# EAGLE board qcd-23 (EAGLE 7.2.0)
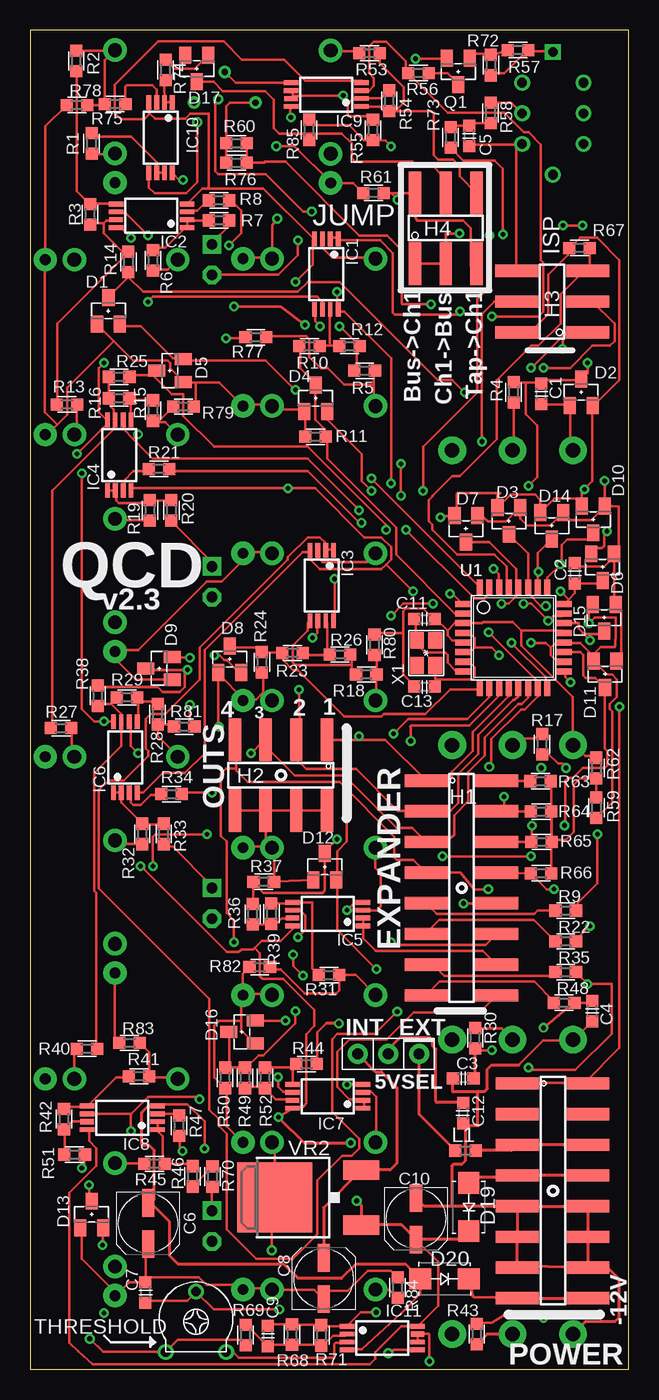
[diagram p1: board, top side]
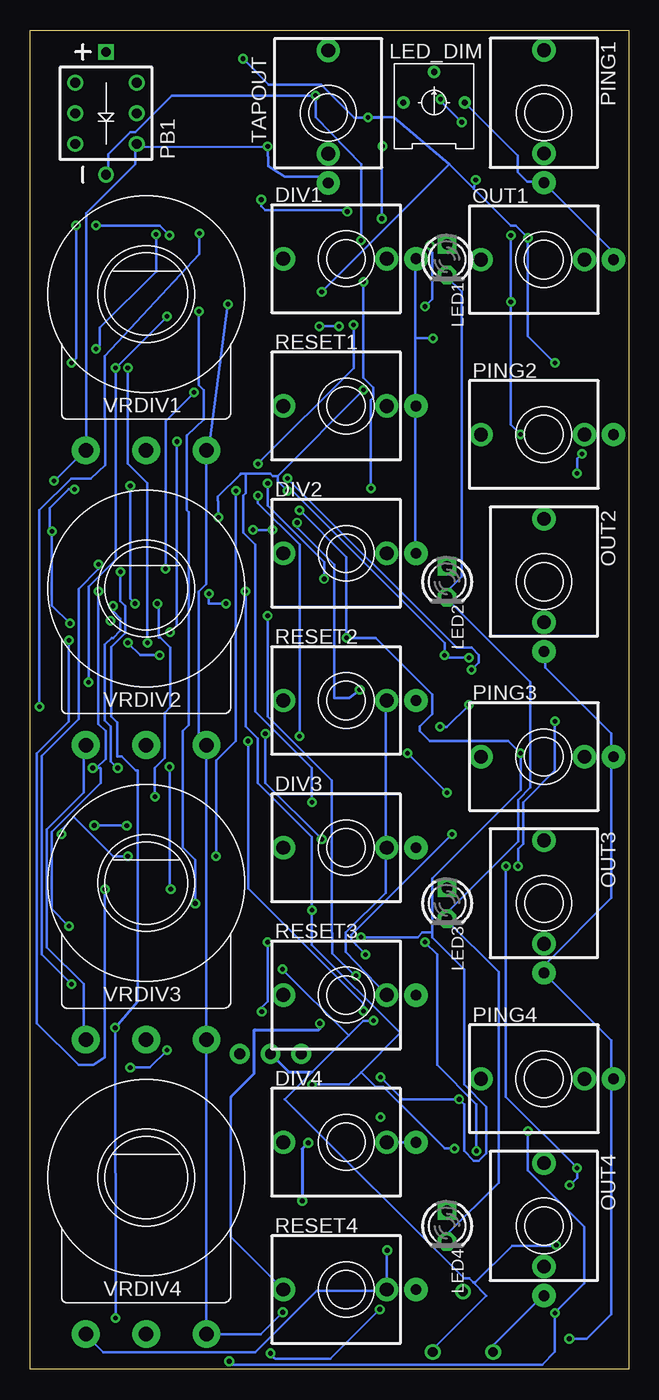
[diagram p2: board, bottom side, seen from below]

Size 49.53 x 110.87 mm. Coordinates in mm from the lower left corner, seen from the top.
Outline: 0,0 49.53,0 49.53,110.87 0,110.87 0,0
Copper layers (1*16): Top 0.035mm / dielectric 1.5mm / Bottom 0.035mm
Design rules "default *": minimum track width 8mil, minimum drill 15mil, track to track 8mil, track to pad 8mil, pad to pad 8mil, via to via 8mil, smd to smd 8mil, copper to edge 10mil, drill to drill 8mil, minimum pad ring 10mil, minimum via ring 8mil, stop-mask expansion 4mil, vias tented up to drill 16mil, thermal gap 10mil

## Footprints (pad centres in the part's own frame; a part is rotated, then mirrored left to right if it is on the bottom)
HEADER-1X3-TH = drill 0.9 pad 1.651: P$1 0,2.54; P$2 0,0; P$3 0,-2.54
C0603 = smd 1 x 1: 1 -0.85,0; 2 0.85,0
C-POL-5 = smd 2.3 x 1: + 1.725,0; - -1.7,0
SOT23 = smd 1 x 1.4: 1 -0.95,-1.1; 2 0.95,-1.1; 3 0,1.1
SMA = smd 1.8 x 1.7: A -2,0; K 2,0
PJ301M-12-FIX = drill 1.143 pad 1.93: 1 -5.207,0; 3 3.353,0 | drill 0.889 pad 1.93: 2 5.766,0
HEADER-2X8-SMT = smd 1.016 x 3.556: 1 -8.89,-2.95; 2 -8.89,2.899; 3 -6.35,-2.95; 4 -6.35,2.899; 5 -3.81,-2.95; 6 -3.81,2.899; 7 -1.27,-2.95; 8 -1.27,2.899; 9 1.27,-2.95; 10 1.27,2.899; 11 3.81,-2.95; 12 3.81,2.899; 13 6.35,-2.95; 14 6.35,2.899; 15 8.89,-2.95; 16 8.89,2.899
HEADER-2X4-SMT = smd 1.016 x 3.556: 1 -3.81,-2.95; 2 -3.81,2.899; 3 -1.27,-2.95; 4 -1.27,2.899; 5 1.27,-2.95; 6 1.27,2.899; 7 3.81,-2.95; 8 3.81,2.899
HEADER-2X3-SMT = smd 1.016 x 3.556: 1 -2.54,-2.95; 2 -2.54,2.899; 3 0,-2.95; 4 0,2.899; 5 2.54,-2.95; 6 2.54,2.899
TSSOP8 = smd 0.4 x 1.2: 1 -0.975,-2.925; 2 -0.325,-2.925; 3 0.325,-2.925; 4 0.975,-2.925; 5 0.975,2.925; 6 0.325,2.925; 7 -0.325,2.925; 8 -0.975,2.925
0603 = smd 1 x 1: 1 -0.85,0; 2 0.85,0
LED-T1 = drill 0.889 pad 1.524 square: A -1.27,0 | drill 0.889 pad 1.524 octagon: K 1.27,0
TRIM-T73YE = drill 0.508 pad 1.016: 1 -2.54,0; 2 0,2.54; 3 2.54,0
BUTTON-LED-PB61303 = drill 0.8: P$1 2.54,2.54; P$2 0,2.54; P$3 -2.54,2.54; P$4 2.54,-2.54; P$5 0,-2.54; P$6 -2.54,-2.54; P$8 -5.08,0 | drill 0.8 square: P$7 5.08,0
R0603 = smd 1 x 1: 1 -0.85,0; 2 0.85,0
PIHER-6MM = drill 0.8: 1 -2.5,-2.5; 2 0,2.5; 3 2.5,-2.5
TQFP-32 = smd 1.25 x 0.5: 1 -4.2,2.8; 2 -4.2,2; 3 -4.2,1.2; 4 -4.2,0.4; 5 -4.2,-0.4; 6 -4.2,-1.2; 7 -4.2,-2; 8 -4.2,-2.8; 17 4.2,-2.8; 18 4.2,-2; 19 4.2,-1.2; 20 4.2,-0.4; 21 4.2,0.4; 22 4.2,1.2; 23 4.2,2; 24 4.2,2.8 | smd 0.5 x 1.25: 9 -2.8,-4.2; 10 -2,-4.2; 11 -1.2,-4.2; 12 -0.4,-4.2; 13 0.4,-4.2; 14 1.2,-4.2; 15 2,-4.2; 16 2.8,-4.2; 25 2.8,4.2; 26 2,4.2; 27 1.2,4.2; 28 0.4,4.2; 29 -0.4,4.2; 30 -1.2,4.2; 31 -2,4.2; 32 -2.8,4.2
DPAK = smd 1.6 x 3: 1 -2.28,-4.8; 3 2.28,-4.8 | smd 5.8 x 6.2: 4 0,2.38
16MM-RV16AF-4A = drill 1.2 pad 2.286: 1 -5,-12.954; 2 0,-12.954; 3 5,-12.954
FA-238 = smd 1.4 x 1.15: 1 -1.05,-0.75; 2 1.05,-0.75; 3 1.05,0.75; 4 -1.05,0.75

## Placement (x,y rotation side)
5VSEL  HEADER-1X3-TH  [HEADER-1X3-TH]  29.64,26.11 270 top
C1  10nF  [C0603]  42.29,80.77 270 top
C2  10nF  [C0603]  45.09,65.91 90 top
C3  10nF  [C0603]  35.84,24.1 180 top
C4  10nF  [C0603]  46.51,29.67 270 top
C5  0.1uF  [C0603]  36.32,102.11 270 top
C6  47uF  [C-POL-5]  9.75,12.09 270 top
C7  0.1uF  [C0603]  9.53,6.35 270 top
C8  47uF  [C-POL-5]  24.28,7.52 90 top
C9  0.1uF  [C0603]  19.66,2.77 270 top
C10  47uF  [C-POL-5]  31.93,12.47 270 top
C11  9pF  [C0603]  32.64,62.1 0 top
C12  0.1uF  [C0603]  35.84,21.21 90 top
C13  9pF  [C0603]  32.64,56.52 180 top
D1  BAT54S  [SOT23]  6.48,87.63 0 top
D2  BAT54S  [SOT23]  45.59,80.9 0 top
D3  BAT54S  [SOT23]  39.62,70.23 180 top
D4  BAT54S  [SOT23]  23.62,80.39 0 top
D5  BAT54S  [SOT23]  11.56,82.68 90 top
D6  BAT54S  [SOT23]  47.37,66.42 180 top
D7  BAT54S  [SOT23]  36.07,69.6 180 top
D8  BAT54S  [SOT23]  16.51,58.8 0 top
D9  BAT54S  [SOT23]  10.67,58.04 90 top
D10  BAT54S  [SOT23]  46.61,70.36 180 top
D11  BAT54S  [SOT23]  47.57,57.56 180 top
D12  BAT54S  [SOT23]  24.38,41.61 0 top
D13  BAT54S  [SOT23]  5.08,12.83 0 top
D14  BAT54S  [SOT23]  43.18,69.85 180 top
D15  BAT54S  [SOT23]  47.5,62.23 180 top
D16  BAT54S  [SOT23]  17.53,27.94 90 top
D17  BAT54S  [SOT23]  13.79,107.7 180 top
D19  B140-E3  [SMA]  36.3,13.44 270 top
D20  B140-E3  [SMA]  34.29,7.49 0 top
DIV1  [PJ301M-12-FIX]  23.37,91.95 0 bottom
DIV2  [PJ301M-12-FIX]  23.37,67.56 0 bottom
DIV3  [PJ301M-12-FIX]  23.37,43.18 0 bottom
DIV4  [PJ301M-12-FIX]  23.37,18.8 0 bottom
H1  HEADER-2X8BARE  [HEADER-2X8-SMT]  35.71,39.85 270 top
H2  HEADER-2x4-MALE-SMT  [HEADER-2X4-SMT]  20.75,49.17 180 top
H3  HEADER-2x3-MALE-SMT  [HEADER-2X3-SMT]  43.18,88.39 90 top
H4  HEADER-2x3-MALE-SMT  [HEADER-2X3-SMT]  34.39,94.49 0 top
IC1  TL072  [TSSOP8]  24.51,90.68 180 top
IC2  TL072  [TSSOP8]  10.03,95.5 90 top
IC3  TL072  [TSSOP8]  24.13,64.9 180 top
IC4  TL072  [TSSOP8]  7.37,75.69 0 top
IC5  TL072  [TSSOP8]  24.64,37.69 90 top
IC6  TL072  [TSSOP8]  7.87,50.67 0 top
IC7  TL072  [TSSOP8]  24.64,22.61 90 top
IC8  TL072  [TSSOP8]  7.62,20.83 90 top
IC9  TL072  [TSSOP8]  24.51,105.54 90 top
IC10  TL072  [TSSOP8]  10.79,101.98 180 top
IC11  TL072  [TSSOP8]  29.13,2.59 270 top
L1  BEAD  [0603]  36.02,18.11 180 top
LED1  RED  [LED-T1]  15.04,91.87 270 bottom
LED2  WHITE  [LED-T1]  15.04,65.2 270 bottom
LED3  BLUE  [LED-T1]  15.04,38.58 270 bottom
LED4  GREEN  [LED-T1]  15.04,11.86 270 bottom
LED_DIM  10k plastic  [TRIM-T73YE]  16.1,104.88 0 bottom
OUT1  [PJ301M-12-FIX]  7.01,91.87 0 bottom
OUT2  [PJ301M-12-FIX]  7.01,65.2 270 bottom
OUT3  [PJ301M-12-FIX]  7.01,38.58 270 bottom
OUT4  [PJ301M-12-FIX]  7.01,11.86 270 bottom
PB1  WHITE-MOM  [BUTTON-LED-PB61303]  43.26,103.99 90 bottom
PING1  [PJ301M-12-FIX]  7.01,104.01 270 bottom
PING2  [PJ301M-12-FIX]  7.01,77.39 0 bottom
PING3  [PJ301M-12-FIX]  7.01,50.72 0 bottom
PING4  [PJ301M-12-FIX]  7.01,24.05 0 bottom
POWER  HEADER-2X8-SMT  [HEADER-2X8-SMT]  43.26,14.78 270 top
Q1  2N5485  [SOT23]  35.43,107.44 180 top
R1  10k  [R0603]  5.08,101.5 270 top
R2  1k  [R0603]  3.81,108.33 270 top
R3  1M  [R0603]  4.95,95.63 270 top
R4  220k  [R0603]  40.01,80.9 90 top
R5  1k  [R0603]  27.69,82.68 180 top
R6  1k  [R0603]  10.16,91.82 90 top
R7  10k  [R0603]  15.62,95.12 180 top
R8  10k  [R0603]  15.62,96.77 0 top
R9  220k  [R0603]  44.32,37.97 0 top
R10  10k  [R0603]  23.11,84.71 180 top
R11  1M  [R0603]  23.62,77.22 0 top
R12  1M  [R0603]  26.42,84.71 180 top
R13  10k  [R0603]  3.05,79.88 0 top
R14  10k  [R0603]  8.13,91.69 90 top
R15  1k  [R0603]  10.16,79.38 90 top
R16  1M  [R0603]  7.37,80.39 180 top
R17  220k  [R0603]  42.37,51.77 270 top
R18  1k  [R0603]  27.81,57.53 180 top
R19  1k  [R0603]  9.91,71.12 90 top
R20  10k  [R0603]  11.68,71.12 90 top
R21  10k  [R0603]  10.67,74.55 0 top
R22  220k  [R0603]  44.32,35.43 0 top
R23  10k  [R0603]  21.72,59.31 180 top
R24  1M  [R0603]  19.18,58.55 90 top
R25  10k  [R0603]  7.37,82.17 180 top
R26  1M  [R0603]  25.65,59.18 180 top
R27  10k  [R0603]  2.54,53.09 0 top
R28  1k  [R0603]  10.54,54.23 90 top
R29  1M  [R0603]  8,55.63 180 top
R30  220k  [R0603]  36.83,27.43 270 top
R31  1k  [R0603]  24.74,32.64 180 top
R32  1k  [R0603]  9.27,44.32 90 top
R33  10k  [R0603]  11.05,44.32 90 top
R34  10k  [R0603]  11.68,47.62 0 top
R35  220k  [R0603]  44.32,32.89 0 top
R36  10k  [R0603]  18.41,37.67 90 top
R37  1M  [R0603]  19.33,40.36 180 top
R38  10k  [R0603]  5.59,55.75 270 top
R39  1M  [R0603]  19.96,37.72 270 top
R40  10k  [R0603]  4.7,26.54 180 top
R41  1k  [R0603]  9.02,24.26 180 top
R42  1M  [R0603]  2.79,20.7 270 top
R43  220k  [R0603]  36.96,2.92 90 top
R44  1k  [R0603]  22.86,25.27 180 top
R45  1k  [R0603]  10.29,17.02 0 top
R46  10k  [R0603]  13.44,15.98 90 top
R47  10k  [R0603]  12.32,20.19 270 top
R48  220k  [R0603]  44.2,30.35 0 top
R49  10k  [R0603]  17.78,24.13 90 top
R50  1M  [R0603]  16.13,24.13 90 top
R51  10k  [R0603]  3.68,17.78 180 top
R52  1M  [R0603]  19.43,24.13 270 top
R53  1k  [R0603]  28.07,108.97 0 top
R54  10k  [R0603]  29.72,105.03 90 top
R55  10k  [R0603]  28.37,102.62 270 top
R56  220k  [R0603]  32.13,107.31 180 top
R57  1k  [R0603]  40.39,109.22 180 top
R58  1k  [R0603]  38.1,104.01 270 top
R59  10k  [R0603]  46.86,46.48 270 top
R60  100k  [R0603]  17.07,101.5 0 top
R61  1M  [R0603]  28.42,97.38 180 top
R62  10k  [R0603]  46.86,49.78 270 top
R63  1M  [R0603]  42.24,48.69 0 top
R64  1M  [R0603]  42.27,46.18 0 top
R65  1M  [R0603]  42.32,43.66 0 top
R66  1M  [R0603]  42.27,41.07 0 top
R67  10k  [R0603]  45.47,92.84 0 top
R68  10k  [R0603]  21.67,2.87 90 top
R69  10k  [R0603]  17.83,2.84 90 top
R70  10k  [R0603]  15.09,15.95 90 top
R71  33k  [R0603]  24.1,2.82 90 top
R72  1k  [R0603]  38.13,107.98 90 top
R73  10k  [R0603]  34.8,101.98 270 top
R74  100  [R0603]  11.2,107.57 270 top
R75  1k  [R0603]  7.04,104.75 180 top
R76  33k  [R0603]  17.07,99.9 0 top
R77  1M  [R0603]  18.67,85.45 180 top
R78  1M  [R0603]  3.86,104.67 0 top
R79  1M  [R0603]  12.67,79.71 180 top
R80  1M  [R0603]  28.5,59.99 270 top
R81  1M  [R0603]  12.75,53.21 180 top
R82  1M  [R0603]  19,33.3 0 top
R83  1M  [R0603]  8.23,27.03 0 top
R84  1M  [R0603]  30.4,6.76 270 top
R85  1M  [R0603]  23.09,102.62 270 top
RESET1  [PJ301M-12-FIX]  23.37,79.76 0 bottom
RESET2  [PJ301M-12-FIX]  23.37,55.37 0 bottom
RESET3  [PJ301M-12-FIX]  23.37,30.99 0 bottom
RESET4  [PJ301M-12-FIX]  23.37,6.6 0 bottom
TAPOUT  [PJ301M-12-FIX]  24.87,103.99 270 bottom
THRESHOLD  100k  [PIHER-6MM]  13.72,3.94 0 top
U1  ATMEGA328  [TQFP-32]  40.01,60.58 0 top
VR2  78M05  [DPAK]  22.61,14.22 90 top
VRDIV1  16MM-21DET  [16MM-RV16AF-4A]  39.93,89.03 0 bottom
VRDIV2  16MM-21DET  [16MM-RV16AF-4A]  39.93,64.64 0 bottom
VRDIV3  16MM-21DET  [16MM-RV16AF-4A]  39.93,40.26 0 bottom
VRDIV4  16MM-21DET  [16MM-RV16AF-4A]  39.93,15.88 0 bottom
X1  16MHz  [FA-238]  32.77,59.31 90 top

## Tracks (layer width: path | path; a pad name or v marks a point on that pad's centre or on a via)
+5V  (via drill 0.38, 0.38 pad 0.79)
  Top 0.203: D6.2 46.9,68 47.32,68 47.5,68.17 47.5,69.37 v47.73,69.37 | D15.2 46.23,63.01 v46.23,61.75 46.74,62.26 48.44,62.26 48.46,62.23 48.46,60.5 48.44,60.48 48.44,59.89 48.36,59.82 47.22,59.82 46.62,59.22 D11.2 | v21.13,28.85 18.69,28.85 D16.2 | v5.99,10.29 6.02,10.77 6.1,11.58 D13.2 | D1.2 7.52,86.36 9.14,86.36 11.79,83.72 12.6,83.72 D5.2 12.8,83.52 19.51,83.52 v21.95,81.08 | v13.21,58.93 11.79,58.93 D9.2 | v15.24,59.13 15.65,59.13 16.05,58.73 16.26,58.73 17.27,57.71 D8.2 | v28.25,72.75 27.43,73.56 27.43,75.79 24.59,78.64 24.59,79.25 D4.2 | H3.2 40.44,85.95 41.45,85.95 42.88,87.38 42.88,90.63 44.5,92.25 44.5,92.66 R67.1 44.7,92.86 45.52,93.67 46.94,93.67 48.77,91.85 48.77,81.89 46.74,79.86 D2.2 46.53,79.65 46.53,73.56 45.92,72.95 v45.87,72.87 45.66,72.66 D10.2 45.66,71.64 45.19,72.11 43.39,72.11 D14.2 42.23,71.97 41.78,72.42 39.76,72.42 D3.2 38.67,72.33 38.91,72.57 35.36,72.57 35.31,72.52 35.31,70.88 D7.2 35.03,70.66 34.09,70.66 v33.96,70.54 | 36.78,59.74 36.58,59.54 35.97,59.54 U1.6 | 36.78,59.74 36.78,60.55 36.37,60.96 35.97,60.96 U1.4 | 43.08,59.74 43.08,59.13 43.48,58.73 44.09,58.73 U1.18 | 43.08,59.74 43.48,60.15 44.09,60.15 U1.20 44.3,60.15 45.52,60.15 46.53,59.13 D11.2 | 36.78,59.74 38.2,59.74 v38.81,59.13 | v41.45,60.15 42.67,60.15 43.08,59.74 | D11.2 46.74,58.52 47.75,57.51 48.16,57.51 48.56,57.1 48.56,55.68 47.95,55.07 47.95,54.66 48.16,54.46 48.16,46.94 46.94,45.72 R59.2 46.74,45.52 | IC11.3 26.15,2.21 25.3,2.21 25.15,2.06 25.15,0.94 17.25,0.94 16.75,1.44 THRESHOLD.3 | v28.65,33.12 25.4,36.37 25.4,40.44 D12.2 25.4,40.64 25.4,42.88 26.21,43.69 v26.21,46.94
  Top 0.254: C12.2 35.8,22.1 33.63,22.1 33.58,22.17 33.58,26.49 33.33,26.75 33.33,27.23 33.12,27.43 30.58,27.43 29.64,26.49 5VSEL.P$2
  Bottom 0.203: v45.87,72.87 46.33,72.87 47.9,71.3 47.9,69.55 v47.73,69.37 47.73,63.25 v46.23,61.75 | v21.13,28.85 21.95,28.85 23.16,27.64 | 23.16,27.64 26.19,24.61 28.45,22.35 13.61,7.52 13.21,7.52 12.88,7.19 | THRESHOLD.3 16.26,1.63 11.79,6.1 12.88,7.19 | v13.21,58.93 15.04,58.93 v15.24,59.13 15.24,60.15 27.84,72.75 v28.25,72.75 29.06,73.56 29.06,73.97 | 29.06,73.97 v21.95,81.08 | v38.81,59.13 40.44,59.13 v41.45,60.15 | 29.06,73.97 29.46,73.97 29.67,74.17 31.7,74.17 | 31.7,74.17 32.11,74.17 32.16,74.09 34.01,72.24 34.01,71.91 33.96,71.83 v33.96,70.54 | v28.65,33.12 23.16,27.64 | v5.99,10.29 6.04,10.24 9.65,10.24 12.7,7.19 12.88,7.19 | v26.21,46.94 26.21,49.78 30.89,54.46 30.89,68.28 31.9,69.29 31.9,72.34 31.7,72.54 31.7,74.17
  Bottom 0.254: 5VSEL.P$2 28.14,24.61 26.19,24.61
+12V  (via drill 0.38, 0.41)
  Top 0.203: IC8.8 4.88,19.71 4.88,18.9 5.49,18.29 5.49,16.87 3.25,14.63 3.25,2.21 3.96,1.5 5.16,0.41 28.12,0.41 28.57,0.86 28.57,1.42 30.72,3.57 IC11.8 33.76,5.26 33.76,8.89 31.93,10.72 C10.+ | v20.55,20.88 21.57,21.54 IC7.8 21.74,21.74 22.58,21.74 22.86,22.02 22.86,27.74 23.5,28.45 23.5,29.74 20.93,32.31 19.23,32.31 19,32.54 19,34.44 18.57,34.87 18.57,34.9 | v25.2,65.43 25.2,61.98 IC3.8 | v29.87,73.36 29.87,83.72 26.01,87.58 25.6,87.58 IC1.8 25.4,87.78 v25.4,89.2 | v4.27,74.17 4.27,54.66 5.28,53.65 v6.1,53.65 6.71,53.65 IC6.8 | v3.86,75.79 6.3,78.23 6.3,78.44 IC4.8 6.3,78.64 5.69,79.25 5.69,82.91 v6.1,83.31 | v8.33,93.67 7.52,94.49 7.11,94.49 IC2.8 | v21.57,103.66 21.54,104.44 IC9.8 | v31.9,108.51 34.34,108.51 Q1.2 | v9.14,41.66 16.26,34.54 17.27,34.54 17.51,34.78 18.45,34.78 18.57,34.9 | 21.54,36.58 IC5.8 21.71,36.47 20.73,35.48 19.15,35.48 18.57,34.9 | IC10.8 12.39,98.43 v12.65,98.48
  Top 0.254: D19.K 35.61,10.75 C10.+ 30.73,11.94 VR2.1 27.41,13.56 v27.03,13.95 | v20.55,20.88 22.68,18.75 v26.52,18.75
  Bottom 0.203: v25.2,65.43 25.2,66.85 29.87,71.53 v29.87,73.36 | v4.27,74.17 4.27,75.39 v3.86,75.79 | v6.1,83.31 8.33,85.55 v8.33,93.67 9.35,94.69 9.75,94.69 12.83,97.77 | 12.83,97.77 14.83,99.77 | 14.83,99.77 19.43,103.68 v21.57,103.66 21.31,103.61 20.42,103.63 22.71,103.63 25.45,106.38 29.77,106.38 v31.9,108.51 | 14.83,99.77 v25.4,89.2 | v9.14,41.66 9.14,43.08 8.74,43.48 8.74,46.94 6.1,49.58 v6.1,53.65 | v12.65,98.48 12.8,97.77 12.83,97.77
  Bottom 0.254: v26.52,18.75 27.03,18.24 v27.03,13.95
+VREF  (via drill 0.38, 0.41)
  Top 0.203: v33.17,88.19 30.81,88.19 30.73,88.27 30.73,92.66 29.87,93.52 29.87,93.55 29.54,93.88 27.23,93.88 21.13,99.97 19.43,99.97 19.36,99.9 R76.2 R60.2 | C9.1 19.76,3.72 R68.2 21.72,3.67 R71.2 24.21,3.57 IC11.1 27.37,4.72 v28.63,4.72
  Bottom 0.203: v33.17,88.19 34.75,76.2 VRDIV1.3 34.95,76 34.95,65.02 35.56,64.41 35.56,52.43 34.95,51.82 VRDIV2.3 34.95,51.61 34.95,27.43 VRDIV3.3 34.95,27.23 34.95,3.05 VRDIV4.3 30.43,2.92 v28.63,4.72
-12V  (via drill 0.38)
  Top 0.203: 9.96,13.61 C6.- 10.16,13.61 | v14.43,18.29 14.43,20.52 13.01,21.95 10.57,21.95 IC8.4 | 14.63,97.74 19.3,97.74 23.37,93.67 IC1.4 23.37,93.47 23.37,91.44 v21.95,90.02 | 14.63,97.74 14.22,97.74 13.01,96.52 IC2.4 | IC9.4 27.43,106.68 22.76,106.68 21.01,108.43 17.53,108.43 16,109.96 10.62,109.96 7.01,106.35 7.01,103.99 7.49,103.5 9.42,103.5 9.88,103.96 9.91,103.96 | IC6.4 8.94,47.75 9.35,47.75 10.97,49.38 12.8,49.38 14.43,51 14.43,59.54 22.55,67.67 22.96,67.67 IC3.4 23.16,67.67 23.16,67.06 23.98,66.24 29.06,66.24 29.46,66.65 | 29.46,66.65 29.87,67.06 29.87,68.07 29.06,68.89 27.64,68.89 23.57,72.95 v21.34,72.95 8.53,72.95 IC4.4 | v26.21,23.57 27.43,23.57 IC7.4 | IC11.4 26.27,1.68 27.46,1.68 30.73,4.7 32.29,6.25 D20.A | v26.21,38 26.82,38.61 27.43,38.61 IC5.4 | 29.46,66.65 v31.7,64.41 | 9.8,104.92 IC10.4 9.82,104.05 9.91,103.96 | 14.63,97.74 14.78,97.89 14.78,103.96 13.26,103.96 12.83,103.53 10.34,103.53 9.91,103.96
  Top 0.254: D20.A 31.07,8.71 26.95,8.71 25.76,7.52 22.17,7.52 20.98,8.71 12.24,8.71 11.54,9.41 11.54,12.23 9.98,13.79 | 9.98,13.79 C6.- | 9.98,13.79 10.29,14.09 10.29,18.11 9.86,18.54 9.35,18.54 9.25,18.64 9.25,21.26 9.79,21.8 IC8.4
  Bottom 0.203: v26.21,23.57 23.16,23.57 22.15,24.59 | 22.15,24.59 18.9,27.84 26.21,35.15 v26.21,38 26.21,44.09 30.68,48.56 30.68,52.22 31.7,53.24 v31.7,64.41 | v21.95,90.02 21.95,82.09 21.13,81.28 21.13,80.47 21.34,80.26 v21.34,72.95 | v14.43,18.29 15.24,18.29 20.32,23.37 20.93,23.37 22.15,24.59
CLKIN1-SIG
  Top 0.203: R2.1 6.97,109.18 PING1.1 6.19,108.39 R75.2 6.11,104.67 R78.2
CLKIN1-SW
  Top 0.203: IC10.7 IC10.6 10.47,99.94 8.36,102.06 5.37,102.06 R1.1
DIV1_A  (via drill 0.38, 0.41)
  Top 0.203: IC1.2 24.99,93.67 25.4,93.67 IC1.1 25.6,93.47 28.98,93.47 30.02,92.43 30.02,87.48 30.18,87.33 35.31,87.33 v35.56,87.58 | v35.87,38.56 38.1,38.56 38.12,38.58 H1.10
  Bottom 0.203: v35.56,87.58 35.56,81.48 35.15,81.08 35.15,78.64 36.52,77.34 36.58,77.29 36.58,71.14 36.4,70.97 36.4,53.37 36.91,52.86 36.91,43.2 35.87,42.19 v35.87,38.56
DIV1_B
  Top 0.203: H1.9 33.65,37.69 41.73,37.69 42.01,37.97 R9.1
DIV2_A  (via drill 0.38, 0.41)
  Top 0.203: IC3.1 24.99,67.87 24.59,67.87 IC3.2 24.38,67.87 24.38,68.48 23.98,68.89 22.96,68.89 21.34,67.26 21.34,67.06 14.02,59.74 14.02,57.1 11.18,54.25 9.96,54.25 9.55,53.85 9.55,51.41 9.75,51.21 9.75,50.8 7.72,48.77 6.5,48.77 5.69,47.95 5.69,39.83 14.83,30.68 14.83,21.49 15.65,20.68 15.65,20.12 16.26,19.51 16.26,11.58 18.69,9.14 21.74,9.14 23.77,11.18 23.77,15.65 25.81,17.68 26.62,17.68 27.23,18.29 27.23,19.1 24.99,21.34 24.99,27.33 25.43,27.76 28.52,27.76 v30.38,29.62 | H1.12 37.7,35.13 29.87,35.13 | 29.87,35.13 29.49,35.13 | v29.87,35.36 29.87,35.13
  Bottom 0.203: v29.87,35.36 29.87,30.48 30.38,29.97 v30.38,29.62
DIV2_B
  Top 0.203: R22.1 43.46,35.41 41.66,37.21 33.86,37.21 32.76,36.12 H1.11
DIV3_A
  Top 0.203: H1.14 37.47,34.65 28.6,34.65 27.56,35.68 IC5.1 IC5.2
DIV3_B
  Top 0.203: R35.1 43.14,32.56 34.27,32.56 33.33,33.5 H1.13
DIV4_A
  Top 0.203: IC7.1 27.64,21.74 27.64,22.15 IC7.2 27.43,22.35 26.42,22.35 25.4,23.37 25.4,26.26 26.47,27.33 29.52,27.33 31.75,29.57 37.22,29.57 H1.16
DIV4_B
  Top 0.203: 43.28,30.28 R48.1 43.35,30.47 41.71,32.11 33.91,32.11 H1.15
GND  (via drill 0.38, 0.41)
  Top 0.203: C2.2 45.4,66.45 47.5,66.45 48.32,67.27 D6.1 | D6.1 48.69,67.66 48.69,71.45 48.18,71.46 D10.1 | D10.1 46.43,70.33 44.55,70.33 44.13,70.75 D14.1 43.03,69.85 41.15,69.85 40.57,70.42 D3.1 39.37,70.21 37.9,70.21 37.33,70.7 D7.1 | D6.1 48.32,63.46 D15.1 48.92,62.86 48.92,59.05 D11.1 | 19.51,43.28 19.91,43.28 DIV3.3 20.18,43.02 R37.1 20.4,40.4 D12.1 | 19.51,43.28 17.68,43.28 DIV3.2 | 17.68,55.47 15.65,57.51 D8.1 15.56,53.25 v15.62,53.19 | 19.3,56.08 19.3,57.51 R24.1 | RESET2.3 19.3,56.08 | 17.68,55.47 18.69,55.47 19.3,56.08 | 17.68,55.47 RESET2.2 | R62.1 46.74,50.8 45.92,50.8 45.11,51.61 VRDIV2.1 44.91,51.82 44.91,55.68 40.64,59.94 40.64,61.16 | 30.89,60.96 30.89,62.79 31.09,62.99 32.51,62.99 33.33,62.18 C11.2 33.53,62.18 34.54,61.16 | 30.89,60.96 30.89,57.51 31.7,56.69 C13.2 | 34.54,61.16 34.54,60.76 34.95,60.35 35.76,60.35 U1.5 | 34.54,61.16 35.15,61.77 35.76,61.77 U1.3 | 40.64,61.16 44.09,61.16 U1.21 | 36.37,61.77 35.97,61.77 U1.3 | 9.55,7.52 9.55,9.75 9.96,10.16 C6.+ | 9.55,7.52 9.55,7.32 C7.1 | D13.1 4.27,11.58 4.27,9.14 6.91,6.5 6.91,6.1 OUT4.2 7.11,6.1 8.22,7.2 C7.1 | 9.55,7.52 C7.1 | 17.48,28.85 17.48,30.89 RESET3.2 | 17.48,28.85 17.48,28.04 18.49,27.03 D16.1 | RESET3.2 17.68,31.09 19.91,31.09 RESET3.3 | 34.01,13.56 33.53,13.54 | 40.44,25.2 42.47,27.23 44.91,27.23 VRDIV3.1 44.99,27.3 C4.2 | 46.74,8.33 45.92,8.33 POWER.14 | 17.48,28.85 15.65,28.85 15.24,28.45 15.24,24.18 16.05,23.37 R50.1 16.26,23.16 16.26,20.12 17.58,18.8 DIV4.2 | v29.87,101.24 29.44,101.73 R55.2 27.62,101.77 26.39,103 23.56,103 R85.1 | C1.2 42.47,79.86 44.5,79.86 D2.1 44.7,79.65 44.7,76.4 44.91,76.2 VRDIV1.1
  Top 0.203: 40.23,101.4 40.64,101.4 PB1.P$6 40.23,101.4 | 40.23,101.4 36.37,101.4 C5.2 | 39.83,90.83 40.23,90.83 H3.6 40.23,91.03 40.23,101.4 | v47.55,73.56 47.55,71.53 D10.1 | D9.1 11.58,57.1 8.74,57.1 7.11,58.73 7.11,59.33 OUT2.2 7.11,59.54 8.94,59.54 14.63,65.23 15.85,65.23 17.48,66.85 17.48,67.46 DIV2.2 17.68,67.67 19.91,67.67 DIV2.3 | DIV1.2 17.68,92.05 19.91,92.05 DIV1.3 20.02,94.74 v20.45,95.28 | R11.1 22.76,77.22 22.76,79.25 D4.1 22.55,79.45 20.32,79.45 RESET1.3 19.91,79.86 17.68,79.86 RESET1.2 17.48,79.86 15.65,81.69 13.72,81.69 | 13.72,81.69 12.8,81.69 D5.1 12.6,81.89 11.58,82.91 11.58,83.31 11.38,83.52 8.53,83.52 6.91,85.14 | 6.91,85.14 5.69,86.36 D1.1 | 2.23,78.23 3.05,79.05 3.05,81.28 6.91,85.14 | 2.23,78.23 1.42,77.42 PING2.2 | 2.23,78.23 1.22,79.25 1.22,91.85 OUT1.2 1.25,102.91 R78.1 | R69.1 17.39,2.44 12.19,2.44 11.38,1.63 THRESHOLD.1 6.03,1.44 v4.93,2.54 | DIV4.3 20.23,18.59 VR2.4 19.99,13.99 v19.99,9.86 | H2.8 H2.6 | H2.6 21.95,46.27 | 21.95,46.27 H2.4 | H2.4 H2.2 | H2.6 19.51,46.25 19.51,43.28 | 40.64,61.16 39.93,61.87 37.52,61.87 37.42,61.78 U1.3 | H2.4 21.95,46.33 21.95,46.27 | v20.37,101.27 21.87,101.27 24.87,98.27 TAPOUT.2 26.73,98.22 R61.2 | C7.1 9.53,7.62 13.97,7.62 14.61,6.99 17.14,6.99 RESET4.2 17.68,6.71 19.91,6.71 RESET4.3 23.5,6.6 C8.- 24.28,6.02 24.77,6.5 26.29,6.5 27.94,8.15 29.86,8.15 R84.1 | R77.2 17.74,85.37 v16.2,85.37 | R79.1 13.72,79.9 13.72,81.69 | R80.1 28.61,60.96 30.89,60.96 | R81.1 13.21,53.61 v13.21,55.02 | R82.1 17.6,32.75 RESET3.2 | R83.1 7.01,27.39 OUT3.2
  Top 0.254: POWER.9 POWER.10 POWER.12 POWER.14 | POWER.13 POWER.11 POWER.9 | POWER.14 39.6,8.51 38.91,8.51 38.84,8.59 38.84,8.43 38.91,8.36 | 34.87,13.54 33.53,13.54 32.56,13.54 C10.- | 34.87,13.54 38.02,13.54 POWER.9 | RESET4.3 20.68,6.6 | VRDIV4.1 45.97,3.96 48.41,3.96 48.74,4.29 48.74,7.44 47.75,8.43 POWER.14 | 34.87,13.54 34.87,16.82 35.03,16.97 35.71,16.97 36.02,17.27 36.02,20.18 C12.1 36.01,20.19 37.11,20.19 37.03,20.27 37.03,22.96 | 37.03,22.96 34.98,22.96 34.99,22.98 C3.2 | 37.03,22.96 37.08,23.01 37.62,23.01 37.85,23.24 37.85,24.84 38.2,25.2 40.44,25.2
  Bottom 0.203: 11.38,1.42 THRESHOLD.1 11.18,1.63 11.18,2.03 7.11,6.1 OUT4.2 6.91,6.1 | VRDIV2.1 45.11,51.61 45.11,47.75 48.16,44.7 48.16,34.95 45.11,31.9 45.11,27.43 VRDIV3.1 | 40.84,101.19 40.84,101.4 PB1.P$6 40.84,101.19 | 40.84,101.19 v29.87,101.24 29.84,99.59 28.47,98.75 25.4,98.75 TAPOUT.2 | v47.55,73.56 45.11,76 VRDIV1.1 44.91,76.2 44.91,95.71 40.84,99.77 40.84,101.19 | OUT2.2 6.91,59.33 6.91,58.12 1.42,52.63 1.42,50.8 PING3.2 1.42,50.6 1.42,39.01 6.91,33.53 6.91,32.92 OUT3.2 1.42,27.23 1.42,24.18 PING4.2 1.42,23.98 1.42,4.57 3.45,2.54 v4.93,2.54 | OUT1.2 1.42,92.05 1.42,92.66 PING1.2 7.11,98.35 8.41,98.35 9.17,99.11 9.17,100.48 LED_DIM.3 | DIV2.2 17.68,67.67 17.68,79.65 RESET1.2 17.68,79.86 17.68,85.37 | 17.68,85.37 17.68,91.85 DIV1.2 | DIV4.2 DIV4.3 | v19.99,9.86 20.02,9.83 RESET4.3 20.12,6.5 25.81,6.5 30.89,1.42 43.48,1.42 44.91,2.85 VRDIV4.1 | RESET2.3 20.12,55.27 20.12,43.28 DIV3.3 20.12,43.08 20.12,39.42 23.42,36.17 23.39,34.54 RESET3.3 | v20.37,101.27 20.45,101.19 v20.45,95.28 | v16.2,85.37 17.68,85.37 | v13.21,55.02 15.04,53.19 v15.62,53.19
LED_BIAS  (via drill 0.38)
  Top 0.203: 21.74,105.46 21.74,105.66 IC9.6 | 21.74,105.46 21.74,105.26 IC9.7 | v25.91,105.46 21.74,105.46 | v22.15,93.47 22.15,92.25 20.52,90.63 15.04,90.63 LED1.K
  Bottom 0.203: LED4.K 15.04,11.18 10.77,15.44 10.77,32.92 15.04,37.19 LED3.K 15.04,37.8 9.14,43.69 9.14,47.14 8.13,48.16 8.13,56.9 15.04,63.8 LED2.K 15.04,64.41 13.82,65.63 13.82,89.2 15.04,90.42 LED1.K | PB1.P$8 43.08,98.96 43.08,100.58 41.25,102.41 40.84,102.41 37.8,105.46 v25.91,105.46 25.91,103.66 22.15,99.77 v22.15,93.47
N$1
  Top 0.203: R1.2 5.08,100.58 6.91,100.58 PING1.3
N$2
  Top 0.203: R75.1 7.89,106.18 8,106.3 10.11,106.3 10.47,105.94 IC10.3
N$3
  Top 0.203: 28.45,81.51 28.45,79.86 RESET1.1 | 28.45,81.51 28.45,82.5 R5.1 | R77.1 19.62,85.55 22.86,85.55 23.11,85.29 23.11,83.8 24.03,82.88 24.64,82.88 26.01,81.51 28.45,81.51
N$4
  Top 0.203: OUT1.1 11.38,91.03 10.16,91.03 R6.1
N$5
  Top 0.203: R8.1 14.63,96.72 13.82,95.91 13.01,95.91 IC2.3
N$6  (via drill 0.38)
  Top 0.203: R5.2 27.03,82.7 27.03,84.33 27.23,84.53 R12.1 27.23,84.73 v25.6,86.36 | v23.98,86.36 23.57,86.77 23.57,87.58 IC1.5
  Bottom 0.203: v25.6,86.36 v23.98,86.36
N$7
  Top 0.203: R2.2 3.86,107.29 3.86,97.54 4.88,96.52 R3.1 5.08,96.52 6.91,96.52 IC2.5
N$8
  Top 0.203: IC1.3 24.18,93.47 24.18,92.86 24.99,92.05 28.45,92.05 DIV1.1
N$9
  Top 0.203: R4.1 40.03,79.86 40.03,76.2 VRDIV1.2
N$10
  Top 0.203: R13.2 3.86,79.86 3.86,77.62 3.66,77.42 PING2.3
N$11
  Top 0.203: 10.64,78.44 11.18,78.44 PING2.1 | 10.64,78.44 10.16,78.44 R15.1 | R79.2 10.64,78.52 10.64,78.44
N$12
  Top 0.203: R53.1 27.03,109.12 24.99,109.12 TAPOUT.1
N$13
  Top 0.203: RESET2.1 28.65,55.47 28.65,57.51 R18.1 28.66,58.98 R80.2
N$14
  Top 0.203: 24.79,84.73 25.4,84.73 R12.2 | 24.79,84.73 23.98,84.73 R10.1 | 24.79,84.73 24.79,87.58 IC1.7
N$15
  Top 0.203: R19.1 9.75,70.31 7.11,70.31 OUT2.1
N$16
  Top 0.203: IC6.1 7.52,47.75 IC6.2 7.52,47.55 7.52,46.94 9.14,45.31 R32.2 9.35,45.11 10.97,45.11 R33.2
N$17
  Top 0.203: R7.1 16.46,95.1 16.46,94.69 15.04,93.27 LED1.A
N$18
  Top 0.203: R21.1 9.75,74.37 8.53,74.37 7.72,73.56 7.72,72.95 IC4.3
N$19
  Top 0.203: 26.62,58.32 26.62,57.91 26.82,57.71 R18.2 | 26.62,58.32 26.62,59.13 R26.1 | 26.62,58.32 21.95,58.32 21.74,58.52 21.74,59.94 22.96,61.16 22.96,61.77 IC3.5
N$20
  Top 0.203: 8.33,80.26 8.33,78.64 IC4.5 | 8.33,80.26 10.16,80.26 R15.2 | 8.33,80.26 R16.1
N$21
  Top 0.203: IC4.1 6.5,72.75 6.91,72.75 IC4.2 7.11,72.75 7.11,71.93 7.32,71.73 9.55,71.73 9.75,71.93 R19.2 9.96,71.93 11.58,71.93 R20.2
N$22
  Top 0.203: R17.1 41.66,52.22 40.44,52.22 40.03,51.82 VRDIV2.2
N$23
  Top 0.203: R59.1 R62.2 45.53,48.93 44.98,48.39 44.98,44.5 44.32,43.84 43.34,43.84 R65.2 43.17,46.13 R64.2 | R66.2 R64.2 | R64.2 43.12,48.67 R63.2 | R64.2 43.12,48.63 43.16,48.67 43.16,48.72
N$24
  Top 0.203: 24.59,59.13 22.76,59.13 R23.1 | 24.59,59.13 24.79,59.13 R26.2 24.59,59.13 | 24.59,59.13 24.59,61.77 IC3.7
N$25
  Top 0.203: 13.01,95.1 14.63,95.1 R7.2 | R6.2 10.16,92.86 11.18,92.86 12.8,94.49 IC2.1 13.01,94.69 13.01,95.1 | 13.01,95.1 IC2.2
N$26
  Top 0.203: LED2.A 15.04,66.85 11.79,70.1 R20.1
N$27
  Top 0.203: R27.2 3.45,53.03 3.45,51 3.66,50.8 PING3.3
N$28
  Top 0.203: PING3.1 12.19,50.8 10.57,52.43 10.57,53.24 R28.1 11.73,53.38 R81.2
N$29
  Top 0.203: RESET3.1 26.92,32.64 R31.1 25.59,31.38 25.35,31.14 22.71,31.14 20.75,33.1 20.05,33.1 R82.2
N$30
  Top 0.203: OUT3.1 7.32,43.48 9.14,43.48 R32.1
N$31
  Top 0.203: IC5.3 27.58,38 28.73,38 29.03,38.3 29.03,41.07 28.57,41.53 DIV3.1
N$32
  Top 0.203: R31.2 23.34,33.19 23.34,38.66 23.33,38.67 IC5.5 21.61,38.57 R39.1
N$33
  Top 0.203: 8.94,55.47 9.14,55.27 10.36,55.27 R28.2 | 8.94,55.47 8.94,53.65 IC6.5 | 8.94,55.47 R29.1
N$34
  Top 0.254: D20.K 36.67,5.97 POWER.15 POWER.16
N$35
  Top 0.203: R30.1 36.98,28.25 39.01,28.25 39.83,27.43 VRDIV3.2
N$36
  Top 0.203: 28.42,103.5 28.42,103.53 | 28.42,103.53 R55.1 | R54.2 29.67,105.87 29.06,105.26 27.64,105.26 IC9.2 26.7,105.21 26.29,104.8 26.29,103.83 26.36,103.76 28.19,103.76 28.42,103.53
N$37
  Top 0.203: IC5.7 21.68,37.34 20.83,37.34 20.36,36.87 R39.2 19.91,36.82 R36.1
N$38
  Top 0.203: IC11.2 26.09,2.79 25.09,2.79 24.27,1.97 R71.1 24.05,2.02 R68.1 19.76,2.02 C9.2 17.88,3.69 R69.2
N$39
  Top 0.203: R33.1 11.18,43.28 11.79,43.28 15.04,40.03 LED3.A
N$40
  Top 0.203: PING4.3 3.66,26.42 R40.2
N$41
  Top 0.203: PING4.1 12.19,24.18 9.96,24.18 R41.1 9.87,26.24 R83.2
N$42  (via drill 0.41)
  Top 0.203: 24.51,28.65 23.77,27.91 23.77,25.4 R44.1 | R84.2 29.71,6.6 RESET4.1
  Top 0.254: v25.55,28.63 25.53,28.65 24.51,28.65
  Bottom 0.203: 32.92,22.55 32.92,10.97 28.65,6.71 RESET4.1
  Bottom 0.254: 32.92,22.55 30.99,24.49 30.99,28.07 30.94,28.12 25.63,28.12 25.55,28.19 v25.55,28.63
N$43
  Top 0.203: OUT4.1 9.35,17.07 R45.1
N$44
  Top 0.203: R34.1 10.77,47.55 9.96,47.55 9.14,46.74 8.53,46.74 8.33,46.94 8.33,47.55 IC6.3
N$45
  Top 0.203: 21.74,24.99 19.51,24.99 R52.1 | 21.74,24.99 21.95,25.2 R44.2 21.74,24.99 | 21.74,24.99 21.74,23.77 IC7.5
N$46
  Top 0.203: R42.1 2.85,21.74 4.67,21.74 IC8.5 4.88,21.95 7.11,24.18 8.13,24.18 R41.2
N$47
  Top 0.203: R70.1 15.04,15.05 LED4.A
N$48
  Top 0.254: VRDIV4.2 37.81,2.92 R43.1
N$49
  Top 0.203: R51.2 2.85,17.88 2.85,19.71 R42.2 2.85,19.91 3.45,20.52 4.67,20.52 IC8.7
N$50
  Top 0.203: R49.1 17.88,23.37 19.3,23.37 R52.2 19.51,23.16 20.32,22.35 21.54,22.35 IC7.7
N$51
  Top 0.203: R73.1 34.92,102.96 C5.1 36.53,103.16 R58.2 37.9,102.96
N$52
  Top 0.203: R70.2 13.44,15.15 R46.1
N$53
  Top 0.203: R56.1 33.12,107.29 34.54,107.29 35.36,106.48 Q1.3
N$54
  Top 0.203: R45.2 10.97,17.07 10.97,19.3 10.57,19.71 IC8.1 10.57,19.91 10.57,20.32 IC8.2 | 11.18,16.87 R45.2 | R46.2 13.24,17.02 R45.2
N$55  (via drill 0.41)
  Top 0.203: 9.55,5.49 C7.2 9.55,5.69 13.01,5.69 13.61,6.3 THRESHOLD.2 15.2,4.95 v20.6,4.95 | v29.64,1.32 30.09,1.62 IC11.5
  Bottom 0.203: v20.6,4.95 24.69,0.86 29.26,0.86 29.41,1.02 v29.64,1.32
N$56
  Top 0.203: 38.2,108.92 36.78,108.92 36.58,108.71 Q1.1 | 38.2,108.92 38.61,108.92 R57.2 | 38.2,108.92 R72.2
N$57
  Top 0.203: 43.08,108.92 PB1.P$7 43.08,109.12 41.25,109.12 R57.1 41.05,109.12 39.22,107.29 38.2,107.29 R72.1
N$58
  Top 0.254: POWER.6 POWER.5 39.82,18.11 L1.1
N$59
  Top 0.203: R58.1 38.2,104.85 39.83,104.85 40.64,104.04 PB1.P$5
N$60
  Top 0.203: LED_DIM.1 16.54,104.88 16.23,104.57 16.23,101.51 R60.1 R76.1
N$61
  Top 0.203: LED_DIM.2 17.01,106.51 IC9.5
N$62
  Top 0.254: POWER.8 POWER.7 38.78,15.95 36.25,15.95 36.8,15.64 D19.A
N$63
  Top 0.254: C8.+ 24.28,13.38 VR2.3 29.79,16.5 30.35,17.07 30.35,23.34 29.06,24.64 28.57,24.64 5VSEL.P$3
N$64
  Top 0.254: L1.2 32.18,21.1 5VSEL.P$1
N$65
  Top 0.203: R67.2 46.33,92.66 46.33,91.03 H3.5 46.13,90.83 45.72,90.83 43.89,89 43.89,86.56 42.06,84.73 41.45,84.73 38.61,81.89 38.61,77.01 35.56,73.97 34.95,73.97 33.33,72.34 33.27,72.26 32.97,71.96 32.97,70.26 33.02,70.18 33.27,69.93 33.27,69.57 33.33,69.49 35.36,67.46 38.41,67.46 39.42,66.45 39.42,64.82 U1.29
N$66  (via drill 0.38, 0.38 pad 0.79)
  Top 0.203: v48.77,54.86 48.77,26.62 45.92,23.77 POWER.2 | H4.1 H4.3 34.39,94.03 v35.53,94.03
  Top 0.254: POWER.1 44.4,23.75 44.42,23.72 45.8,23.72 POWER.2
  Bottom 0.203: v48.77,54.86 48.77,71.12 46.13,73.76 44.5,73.76 43.33,74.85 43.36,82.7 43.36,83.87 35.53,92.33 v35.53,94.03
N$67
  Top 0.203: C11.1 31.9,61.98 31.9,60.55 X1.3 32.11,60.35 32.11,59.94 32.72,59.33 34.34,59.33 34.54,59.13 34.54,58.52 35.15,57.91 35.76,57.91 U1.8
N$68  (via drill 0.41)
  Top 0.203: 36.45,91.52 36.45,94.49 35.84,95.1 32.03,95.1 31.85,95.38 H4.2 R61.1 29.87,97.38 v30.4,96.85 | 36.45,91.52 36.45,91.34 | 9.8,99.04 IC10.5 9.83,99.05 9.83,97.84 10.31,97.36 12.9,97.36 13.82,98.27 v13.82,103.25 | v15.57,105.16 15.32,104.9 15.32,99.19 15.54,98.96 19.51,98.96 22.61,95.86 v23.29,95.86 | H4.5 36.91,91.52 36.45,91.52
  Bottom 0.203: v13.82,103.25 15.57,105 v15.57,105.16 | v23.29,95.86 23.39,95.96 30.07,95.96 30.4,96.29 v30.4,96.85
N$69
  Top 0.203: 33.53,57.1 33.53,58.12 X1.1 | 33.53,57.1 33.53,56.69 C13.1 | 33.53,57.1 36.58,57.1 36.78,57.3 36.78,58.12 36.37,58.52 35.97,58.52 U1.7
N$70
  Top 0.203: IC3.3 23.77,67.67 23.77,67.26 24.18,66.85 27.84,66.85 28.45,67.46 DIV2.1
N$71
  Top 0.203: IC10.1 IC10.2 11.11,106.3 R74.2
N$72
  Top 0.203: R47.1 12.19,21.13 10.57,21.13 IC8.3
N$73
  Top 0.203: IC7.3 27.64,22.96 28.25,22.96 28.65,22.55 28.65,18.9 DIV4.1
N$74
  Top 0.203: R74.1 11.2,108.41 11.94,107.67 13.62,107.67 D17.1
N$75
  Top 0.203: H4.4 34.29,97.49 34.29,98.78 34.16,98.78 33.22,99.72 31.9,99.72 31.62,100 26.85,100 26.59,100.25 26.59,101.5 25.78,102.31 23.19,102.31 | 23.19,102.31 20.62,102.31 20.17,102.77 20.17,105.11 19.46,105.82 15.93,105.82 15.2,106.6 D17.3 | R85.2 23.19,101.87 23.19,102.31
PING1
  Top 0.203: 6.1,94.89 5.08,94.89 R3.2 | 6.1,94.89 6.3,95.1 6.91,95.1 IC2.7 | 7.92,92.25 8.13,92.46 R14.2 7.92,92.25 | 7.92,92.25 2.23,86.56 2.23,80.06 R13.1 | 6.1,94.89 6.1,94.08 7.92,92.25
PING2
  Top 0.203: R25.2 6.5,82.09 6.5,80.47 R16.2 6.71,80.26 6.71,79.65 6.91,79.45 6.91,78.64 IC4.7 6.91,78.44 6.91,77.83 1.83,72.75 1.83,53.24 R27.1
PING3
  Top 0.203: 6.71,55.07 5.69,55.07 R38.2 | 6.71,55.07 7.11,55.47 R29.2 | R40.1 5.49,26.62 5.49,39.42 5.28,39.62 5.28,49.38 7.52,51.61 7.52,53.44 IC6.7 7.52,53.65 7.52,54.25 6.71,55.07
TAPOUT
  Top 0.203: 27.12,104.56 IC9.1 27.48,104.52 28.93,104.52 29.27,104.18 R54.1 | R53.2 28.92,108.14 30.91,106.15 30.91,104.88 30.45,104.42 29.96,104.42 R54.1 | H4.6 35.53,98.78 35.53,99.64 35.03,100.15 33.76,100.15 33.4,100.51 33.4,103.99 33.21,104.18 R54.1
UDIVCV1  (via drill 0.38)
  Top 0.203: 41.02,81.69 40.03,81.69 R4.2 | 41.02,81.69 42.27,81.69 C1.1 42.47,81.69 42.67,81.89 45.52,81.89 D2.3 45.72,82.09 46.13,82.5 v46.13,83.31 | v46.94,44.3 46.94,40.23 45.31,38.61 45.31,38 R9.2 | U1.23 44.09,62.38 43.28,62.38 v42.88,61.98 41.45,63.4 v40.84,63.4 | v41.25,73.15 41.96,73.86 41.96,78.13 41.02,79.07 41.02,81.69 | v34.14,42.47 v41.45,42.47 | v32.51,72.75 32.51,76.4 36.98,80.87 36.98,88.59 38,89.61 v38,93.88 | v45.72,94.69 v44.09,94.69
  Bottom 0.203: v46.94,44.3 46.94,44.7 45.92,45.72 42.67,42.47 v41.45,42.47 | v41.25,73.15 41.25,63.8 v40.84,63.4 | v34.14,42.47 34.14,50.39 32.51,52.02 v32.51,72.75 | v38,93.88 38.81,94.69 v44.09,94.69 | v45.72,94.69 45.72,83.72 v46.13,83.31
UDIVCV2  (via drill 0.38, 0.41)
  Top 0.203: D6.3 47.11,65.06 C2.1 45.09,64.26 44.57,63.74 | U1.24 44.57,63.74 | v46.33,36.68 45.11,35.56 R22.2 | v43.89,64.41 44.57,63.74 | R17.2 42.91,50.91 43.69,50.14 44.07,50.14 v44.35,49.78
  Bottom 0.203: v43.89,64.41 43.89,53.44 43.28,52.83 43.28,51.31 43.29,51.3 43.29,50.53 44.04,49.78 v44.35,49.78 43.71,49.78 43.69,49.76 43.69,48.56 47.75,44.5 47.75,38.1 v46.33,36.68
UDIVCV3  (via drill 0.38)
  Top 0.203: D10.3 46.06,68.71 44.45,68.71 43.99,68.25 43.99,66.75 v43.89,66.65 42.8,65.56 U1.25 | R35.2 45.31,32.72 v46.13,31.9 48.13,31.9 48.13,27.79 45.11,24.79 41.25,24.79 v41.25,24.99 | v38.2,26.42 36.98,26.42 R30.2
  Top 0.254: C3.1 36.83,24.25 R30.2
  Bottom 0.203: v38.2,26.42 39.62,24.99 v41.25,24.99 | v43.89,66.65 43.89,66.24 45.52,64.62 45.52,53.85 48.56,50.8 48.56,34.34 v46.13,31.9
UDIVCV4  (via drill 0.38)
  Top 0.203: D14.3 42.01,67.58 42.01,66.04 | 42.01,66.04 U1.26 | v42.47,4.24 39.83,4.83 38.2,3.86 36.98,3.86 R43.2 | v42.49,28.27 44.91,30.28 R48.2 46.34,30.35 C4.1 | v42.06,66.04 42.01,66.04
  Bottom 0.203: v42.47,4.24 v42.49,28.27 40.64,30.48 40.64,49.58 40.79,49.58 41.96,50.75 42.32,50.75 42.34,50.77 42.34,53.57 42.82,54.05 42.82,59.79 41.66,60.96 41.66,63.2 42.06,63.6 v42.06,66.04
UOUT1  (via drill 0.38)
  Top 0.203: U1.12 39.6,55.76 36.63,52.78 36.63,51.21 34.87,49.45 34.87,49 34.75,48.87 32.89,48.87 H1.1 29.38,52.12 27.23,52.12 | 27.23,52.12 H2.1 | v16.46,93.07 17.48,94.08 17.48,95.91 16.66,96.72 R8.2 | v16.87,87.99 20.73,87.99 v22.76,86.46 | v30.68,72.34 v30.68,74.98 | 27.23,52.12 v27.23,52.43
  Bottom 0.203: v16.46,93.07 16.46,92.66 16.26,92.46 16.26,88.59 v16.87,87.99 | v22.76,86.46 22.76,82.91 v30.68,74.98 | v30.68,72.34 30.68,71.73 27.23,68.28 v27.23,52.43
UOUT2  (via drill 0.38, 0.41)
  Top 0.203: v27.43,70.1 27.23,70.1 22.96,74.37 11.58,74.37 R21.2 | U1.13 40.41,55.72 40.08,55.4 39.98,55.4 37.08,52.5 37.08,50.95 35.41,49.28 35.41,46.89 34.8,46.28 32.84,46.28 H1.3 32.74,46.23 30.4,46.23 26.98,49.71 22.84,49.71 22.02,50.47 H2.3 22.3,52.4 v22.25,56.26
  Bottom 0.203: v27.43,70.1 27.43,69.7 24.38,66.65 24.38,55.58 23.11,55.58 v22.25,56.26
UOUT3  (via drill 0.38)
  Top 0.203: 12.6,47.55 R34.2 12.6,47.75 v15.04,47.75 | U1.14 41.2,55.63 40.66,55.09 40.39,55.09 37.62,52.32 37.62,50.83 36.25,49.45 36.25,47.04 35.08,45.87 35.08,44.25 34.85,44.02 33.12,44.02 H1.5 31.62,44.81 30.35,44.81 26.01,49.15 21.89,49.15 19.48,51.56 H2.5 19.3,52.02 v18.29,51
  Bottom 0.203: v18.29,51 v15.04,47.75
UOUT4  (via drill 0.38, 0.41)
  Top 0.203: H3.4 38.41,88.39 37.39,87.38 v37.39,76.81 | v37.95,61.01 41.86,57.1 41.86,56.49 U1.15 42.01,55.7 40.95,54.63 40.64,54.63 38.18,52.17 38.18,50.22 38,50.04 v38,49.89 | v12.6,18.09 12.39,18.29 12.39,19.3 R47.2 | v16.87,35.36 16.87,37.19 16.26,37.8 16.26,43.69 15.77,44.17 15.77,49.28 16.23,49.73 17.07,49.73 | v37.9,39.75 36.75,39.75 35.61,41.12 H1.7 31.72,42.16 30.35,42.16 30.15,42.37 30.15,44.09 25.6,48.64 18.01,48.64 17.07,49.58 17.07,49.73 | 17.07,49.73 17.07,50.72 16.94,50.85 H2.7
  Bottom 0.203: v37.39,76.81 37.39,61.57 v37.95,61.01 | v12.6,18.09 12.6,21.95 15.85,25.2 15.85,34.34 v16.87,35.36 | v37.9,39.75 38,39.98 v38,49.89 37.94,49.95
UPING1  (via drill 0.38)
  Top 0.203: 8.13,90.42 R14.1 | 8.13,90.42 6.5,88.8 D1.3 | v38.33,66.29 38.76,65.86 U1.30 | v35.97,80.87 34.95,81.89 33.73,81.89 25.6,90.02 22.96,90.02 22.15,89.2 9.35,89.2 8.13,90.42
  Bottom 0.203: v38.33,66.29 38.3,78.49 v35.97,80.87
UPING2  (via drill 0.38)
  Top 0.203: 10.16,82.3 8.33,82.3 R25.1 | 10.16,82.3 10.36,82.5 D5.3 10.16,82.3 | v31.09,69.49 36.78,63.8 37.59,63.8 38,64.21 38,64.62 U1.31 | v29.46,69.49 29.46,69.9 22.96,76.4 15.21,76.4 12.68,78.92 12.68,80.72 11.73,80.72 10.16,82.3
  Bottom 0.203: v29.46,69.49 v31.09,69.49
UPING3  (via drill 0.38)
  Top 0.203: 12.8,57.71 12.8,56.49 12.39,56.08 10.97,56.08 10.57,56.49 5.69,56.49 R38.1 | 12.8,57.71 12.6,57.91 9.75,57.91 D9.3 | v28.25,73.76 37.19,64.82 U1.32 | 12.8,57.71 v13.01,57.91
  Bottom 0.203: v28.25,73.76 14.22,59.74 13.01,59.74 12.39,59.13 12.39,58.52 v13.01,57.91
UPING4  (via drill 0.38)
  Top 0.203: v4.27,16.66 4.47,16.87 4.47,17.68 R51.1 | v4.88,15.24 4.88,14.22 5.08,14.02 D13.3 | v34.75,64.21 34.95,64.21 35.76,63.4 U1.1 | v10.16,41.66 10.16,44.09 10.36,44.3 v14.63,44.3 | v33.33,63.4 30.89,63.4 v29.87,62.38 | v22.58,32.59 21.77,33.4 v21.77,34.34
  Bottom 0.203: v4.88,15.24 4.27,15.85 v4.27,16.66 10.16,22.55 v10.16,41.66 | v34.75,64.21 34.75,63.4 v33.33,63.4 | v29.87,62.38 29.87,54.05 24.59,48.77 24.59,36.17 24.51,36.09 24.51,34.44 22.63,32.56 v22.58,32.59 | v14.63,44.3 22.96,35.97 22.96,35.56 22.55,35.15 22.55,35.13 v21.77,34.34
UPW1  (via drill 0.38, 0.41)
  Top 0.203: D3.3 41.2,67.55 U1.27 41.25,64.62 41.25,64.21 42.27,63.2 v42.67,63.2 | H1.2 38.66,48.69 R63.1 42.29,49.59 v42.29,49.78
  Bottom 0.203: v42.67,63.2 42.67,62.79 42.06,62.18 42.06,61.16 42.67,60.55 42.8,60.55 43.36,59.99 43.36,53.72 42.85,53.21 42.85,50.34 v42.29,49.78
UPW2  (via drill 0.38)
  Top 0.203: H1.4 39.57,46.19 | 39.57,46.19 R64.1 | D7.3 36.17,68.48 38,68.48 40.23,66.24 40.23,64.82 U1.28 40.23,64.62 40.23,64.01 39.62,63.4 v39.01,63.4 | v39.22,47.42 39.22,46.55 39.57,46.19
  Bottom 0.203: v39.22,47.42 39.22,49.78 38.41,50.6 38.41,54.36 37.92,54.84 37.92,59.74 38.76,60.58 38.89,60.58 38.89,63.27 v39.01,63.4
UPW3  (via drill 0.41)
  Top 0.203: U1.19 45.52,59.38 45.77,59.13 45.77,57.45 45.97,57.25 46.78,57.25 D11.3 47.55,56.29 47.55,51.41 47.75,51.21 47.75,49.99 47.55,49.78 45.72,49.78 44.91,48.97 44.5,48.97 44.3,48.77 44.3,45.47 v44.22,45.03 | H1.6 R65.1 41.53,43.73 v41.53,45.01
  Bottom 0.203: v44.22,45.03 41.55,45.03 v41.53,45.01
UPW4  (via drill 0.38)
  Top 0.203: D15.3 47.23,60.86 45.87,60.86 45.74,60.98 | 45.74,60.98 45.39,61.34 45.39,61.77 45.38,61.78 U1.22 | H1.8 R66.1 42.74,39.75 v43.36,39.75 | v46.33,60.35 45.72,60.96 45.74,60.98
  Bottom 0.203: v46.33,60.35 46.33,53.65 48.97,51 48.97,28.65 45.52,25.2 44.3,25.2 43.36,25.83 v43.36,39.75
URST1
  Top 0.203: R10.2 22.35,84.53 22.35,82.91 23.57,81.69 D4.3 23.57,81.48 23.57,78.64 24.38,77.83 24.38,77.22 R11.2 24.59,77.22 24.59,75.39 30.28,69.7 30.28,67.46 35.15,62.59 35.76,62.59 U1.2
URST2
  Top 0.203: U1.9 37.19,56.29 34.75,56.29 32.72,54.25 29.26,54.25 29.06,54.05 26.01,54.05 22.15,57.91 21.74,57.91 20.93,58.73 20.93,59.13 R23.2 20.73,59.33 19.3,59.33 R24.2 19.1,59.54 18.9,59.74 16.66,59.74 D8.3
URST3  (via drill 0.38)
  Top 0.203: U1.10 38,56.29 38,55.68 36.17,53.85 31.29,53.85 v30.07,52.63 | R36.2 18.48,38.58 R37.2 19.29,39.45 24.21,39.45 24.38,39.65 D12.3 24.38,42.88 v25.4,43.89
  Bottom 0.203: v30.07,52.63 30.07,48.56 v25.4,43.89
URST4  (via drill 0.38)
  Top 0.203: 16.46,24.99 17.68,24.99 R49.2 17.88,24.99 18.9,26.01 19.3,26.01 21.95,28.65 v21.95,29.67 | 16.46,24.99 16.26,24.99 R50.2 16.46,24.99 | 16.46,24.99 16.46,27.84 D16.3 | U1.11 38.8,55.8 36.32,53.31 31.55,53.31 31.48,53.25 | 31.48,53.25 31.47,53.24 | v31.5,52.02 31.5,53.24 31.48,53.25
  Bottom 0.203: v21.95,29.67 21.95,30.28 31.5,39.83 v31.5,52.02
UTAP  (via drill 0.38, 0.38 pad 0.79)
  Top 0.203: v39.83,60.15 42.67,57.3 42.67,56.49 U1.16 | v41.45,82.91 44.3,85.75 44.42,85.75 | 44.42,85.75 46.13,85.75 H3.1 | v44.07,84.48 44.07,85.39 44.42,85.75 | 34.75,101.08 R73.2 35.85,100.08 38.43,100.08 39.12,99.39 v39.12,93.95
  Bottom 0.203: v39.83,60.15 39.83,73.36 41.45,74.98 v41.45,82.91 | v39.12,93.95 39.12,90.88 43.76,86.23 43.76,84.78 v44.07,84.48
UTAPOUT  (via drill 0.38)
  Top 0.203: IC9.3 27.64,105.87 28.04,105.87 28.45,106.27 28.45,106.88 28.04,107.29 28.04,109.53 28.45,109.93 29.46,109.93 31.09,108.31 31.09,107.49 R56.2 31.29,107.29 34.54,104.04 39.22,104.04 40.84,102.41 41.25,102.41 42.27,101.4 42.27,91.85 42.47,91.64 42.47,87.58 42.06,87.17 v38.2,87.17 | v44.7,56.9 44.3,57.3 44.3,57.71 U1.17 | v42.47,82.91 44.7,82.91 46.53,84.73 47.95,84.73 48.36,85.14 48.36,86.56 46.53,88.39 H3.3
  Bottom 0.203: v44.7,56.9 44.7,64.82 42.47,67.06 v42.47,82.91 v38.2,87.17
VTHRESH  (via drill 0.38, 0.41)
  Top 0.203: 8.33,21.13 8.36,21.13 9.78,22.55 13.82,22.55 v14.02,22.35 | 8.33,21.13 4.88,21.13 IC8.6 | v20.52,24.18 20.52,23.37 20.93,22.96 21.54,22.96 IC7.6 | v8.94,51 8.33,51.61 8.33,53.44 IC6.6 | v23.37,60.55 23.77,60.96 23.77,61.77 IC3.6 | 8.53,77.01 10.16,75.39 22.96,75.39 v27.23,71.12 | 8.53,77.01 7.72,77.83 7.72,78.44 IC4.6 | v9.75,93.88 7.92,95.71 7.11,95.71 IC2.6 | 8.53,77.01 v8.94,77.42 | v9.75,88.39 10.16,88.8 23.77,88.8 24.18,88.39 24.18,87.78 IC1.6 | 8.33,21.13 v8.33,19.71 | v22.15,35.76 22.76,36.37 22.76,37.59 22.35,38 21.74,38 IC5.6 | IC11.6 IC11.7 32.09,2.95 32.97,2.95 33.05,2.87 v33.05,0.66
  Bottom 0.203: v20.52,24.18 18.69,22.35 v14.02,22.35 13.61,21.95 13.61,18.09 12.8,17.27 12.39,17.27 11.79,17.88 11.79,21.74 13.61,23.57 13.61,33.12 16.26,35.76 16.26,36.17 | 16.26,36.17 16.26,40.64 8.94,47.95 v8.94,51 9.96,52.02 16.46,52.02 17.27,52.83 17.27,53.24 16.26,54.25 16.26,55.88 20.93,60.55 v23.37,60.55 23.37,67.26 v27.23,71.12 | v9.75,93.88 v9.75,88.39 9.75,78.23 v8.94,77.42 | v8.33,19.71 8.33,16.46 3.66,11.79 3.66,7.11 v6.1,4.67 6.1,1.45 7.16,0.38 32.77,0.38 v33.05,0.66 | v22.15,35.76 17.48,35.76 17.07,36.17 16.26,36.17

## Text on the board
_tsilk: JUMP: | ISP | Bus->Ch1 | Ch1->Bus | Tap->Ch1 | QCD | v2.3 | 2 | 1 | 4 | 3 | OUTS | EXPANDER | INT | EXT | -12V
_tNames: R72 | R2 | R57 | R53 | R56 | Q1 | R58 | IC9 | R73 | R54 | R60 | C5 | R55 | R1 | R3 | R8 | R7 | H4 | IC2 | IC1 | R67 | R14 | D1 | R6 | H3 | R12 | R25 | R10 | D5 | D4 | R5 | C1 | D2 | R13 | R16 | R4 | R15 | R11 | R21 | D10 | IC4 | D7 | D3 | D14 | R20 | R19 | IC3 | U1 | U1 | D6 | C2 | C11 | D15 | D8 | R26 | D9 | R24 | R38 | R29 | R23 | X1 | R18 | D11 | C13 | R27 | R28 | R17 | R62 | R34 | H2 | IC6 | R63 | R59 | H1 | R64 | D12 | R33 | R65 | R37 | R32 | R66 | R9 | R36 | R39 | IC5 | R22 | R35 | R31 | R48 | C4 | R40 | D16 | R44 | R30 | R41 | C3 | R52 | 5VSEL | R42 | R47 | IC7 | R50 | R49 | L1 | C12 | IC8 | VR2 | R51 | C10 | R45 | R46 | R70 | D19 | C6 | D13 | D20 | R61 | C7 | THRESH | C8 | R43 | R69 | C9 | IC11 | IC10 | R68 | R71 | POWER
_bNames: PING1 | LED_DIM | TAPOUT | PB1 | OUT1 | DIV1 | LED1 | RESET1 | PING2 | VRDIV1 | DIV2 | OUT2 | LED2 | RESET2 | VRDIV2 | PING3 | DIV3 | OUT3 | LED3 | RESET3 | VRDIV3 | PING4 | DIV4 | OUT4 | LED4 | RESET4 | VRDIV4